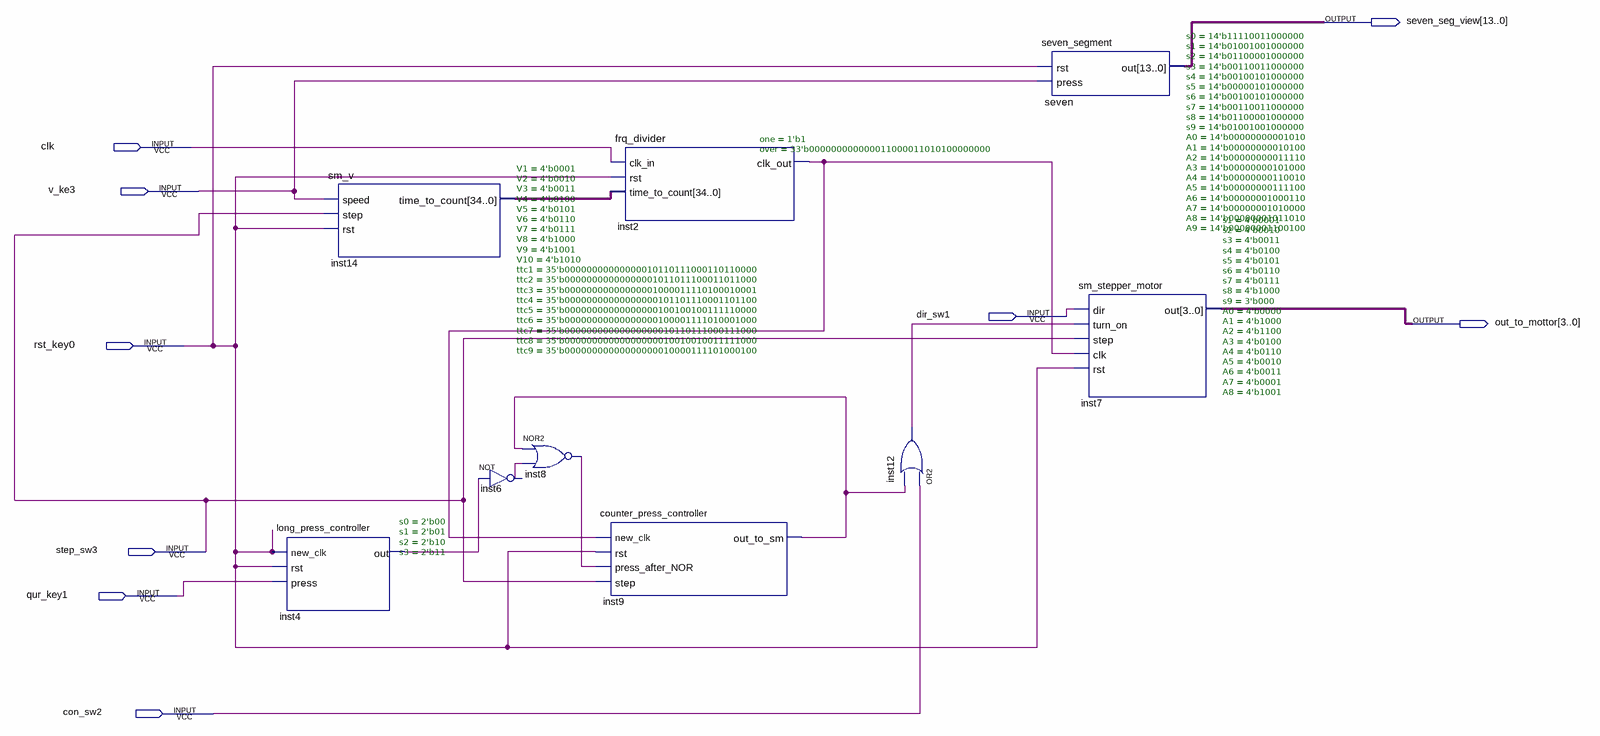
[diagram p0: schematic sheet]
// Quartus schematic Block1.bdf as structural Verilog: 9 symbols, 9 pins
module Block1 (
  input  clk,
  input  v_ke3,
  input  dir_sw1,
  input  rst_key0,
  input  step_sw3,
  input  qur_key1,
  input  con_sw2,
  output [13:0] seven_seg_view,
  output [3:0] out_to_mottor
);

  wire inst2_clk_out, inst4_out, inst6_out, inst8_out, inst9_out_to_sm, inst12_out;
  wire [34:0] inst14_time_to_count;

  long_press_controller #(.s0(2'b00), .s1(2'b01), .s2(2'b10), .s3(2'b11)) inst4 (
    .new_clk(rst_key0), .rst(rst_key0), .press(qur_key1), .out(inst4_out));
  sm_v #(.V1(4'b0001), .V2(4'b0010), .V3(4'b0011), .V4(4'b0100), .V5(4'b0101), .V6(4'b0110), .V7(4'b0111), .V8(4'b1000), .V9(4'b1001), .V10(4'b1010), .ttc1(35'b00000000000000010110111000110110000), .ttc2(35'b00000000000000001011011100011011000), .ttc3(35'b00000000000000001000011110100010001), .ttc4(35'b00000000000000000101101110001101100), .ttc5(35'b00000000000000000100100100111110000), .ttc6(35'b00000000000000000100001111010001000), .ttc7(35'b00000000000000000010110111000111000), .ttc8(35'b00000000000000000010010010011111000), .ttc9(35'b00000000000000000010000111101000100)) inst14 (
    .speed(v_ke3), .step(step_sw3), .rst(rst_key0), .time_to_count(inst14_time_to_count));
  not inst6 (inst6_out, inst4_out);
  nor inst8 (inst8_out, inst9_out_to_sm, inst6_out);
  counter_press_controller inst9 (
    .new_clk(inst2_clk_out), .rst(rst_key0), .press_after_NOR(inst8_out), .step(step_sw3),
    .out_to_sm(inst9_out_to_sm));
  frq_divider #(.one(1'b1), .over(33'b000000000000011000011010100000000)) inst2 (
    .clk_in(clk), .rst(rst_key0), .time_to_count(inst14_time_to_count), .clk_out(inst2_clk_out));
  or inst12 (inst12_out, con_sw2, inst9_out_to_sm);
  seven_segment #(.s0(14'b11110011000000), .s1(14'b01001001000000), .s2(14'b01100001000000), .s3(14'b00110011000000), .s4(14'b00100101000000), .s5(14'b00000101000000), .s6(14'b00100101000000), .s7(14'b00110011000000), .s8(14'b01100001000000), .s9(14'b01001001000000), .A0(14'b00000000001010), .A1(14'b00000000010100), .A2(14'b00000000011110), .A3(14'b00000000101000), .A4(14'b00000000110010), .A5(14'b00000000111100), .A6(14'b00000001000110), .A7(14'b00000001010000), .A8(14'b00000001011010), .A9(14'b00000001100100)) seven (
    .rst(rst_key0), .press(v_ke3), .out(seven_seg_view));
  sm_stepper_motor #(.s1(4'b0001), .s2(4'b0010), .s3(4'b0011), .s4(4'b0100), .s5(4'b0101), .s6(4'b0110), .s7(4'b0111), .s8(4'b1000), .s9(3'b000), .A0(4'b0000), .A1(4'b1000), .A2(4'b1100), .A3(4'b0100), .A4(4'b0110), .A5(4'b0010), .A6(4'b0011), .A7(4'b0001), .A8(4'b1001)) inst7 (
    .dir(dir_sw1), .turn_on(inst12_out), .step(step_sw3), .clk(inst2_clk_out), .rst(rst_key0),
    .out(out_to_mottor));
endmodule
